# EAGLE design ArduinoMEGAReferenceShield (EAGLE 6.3)
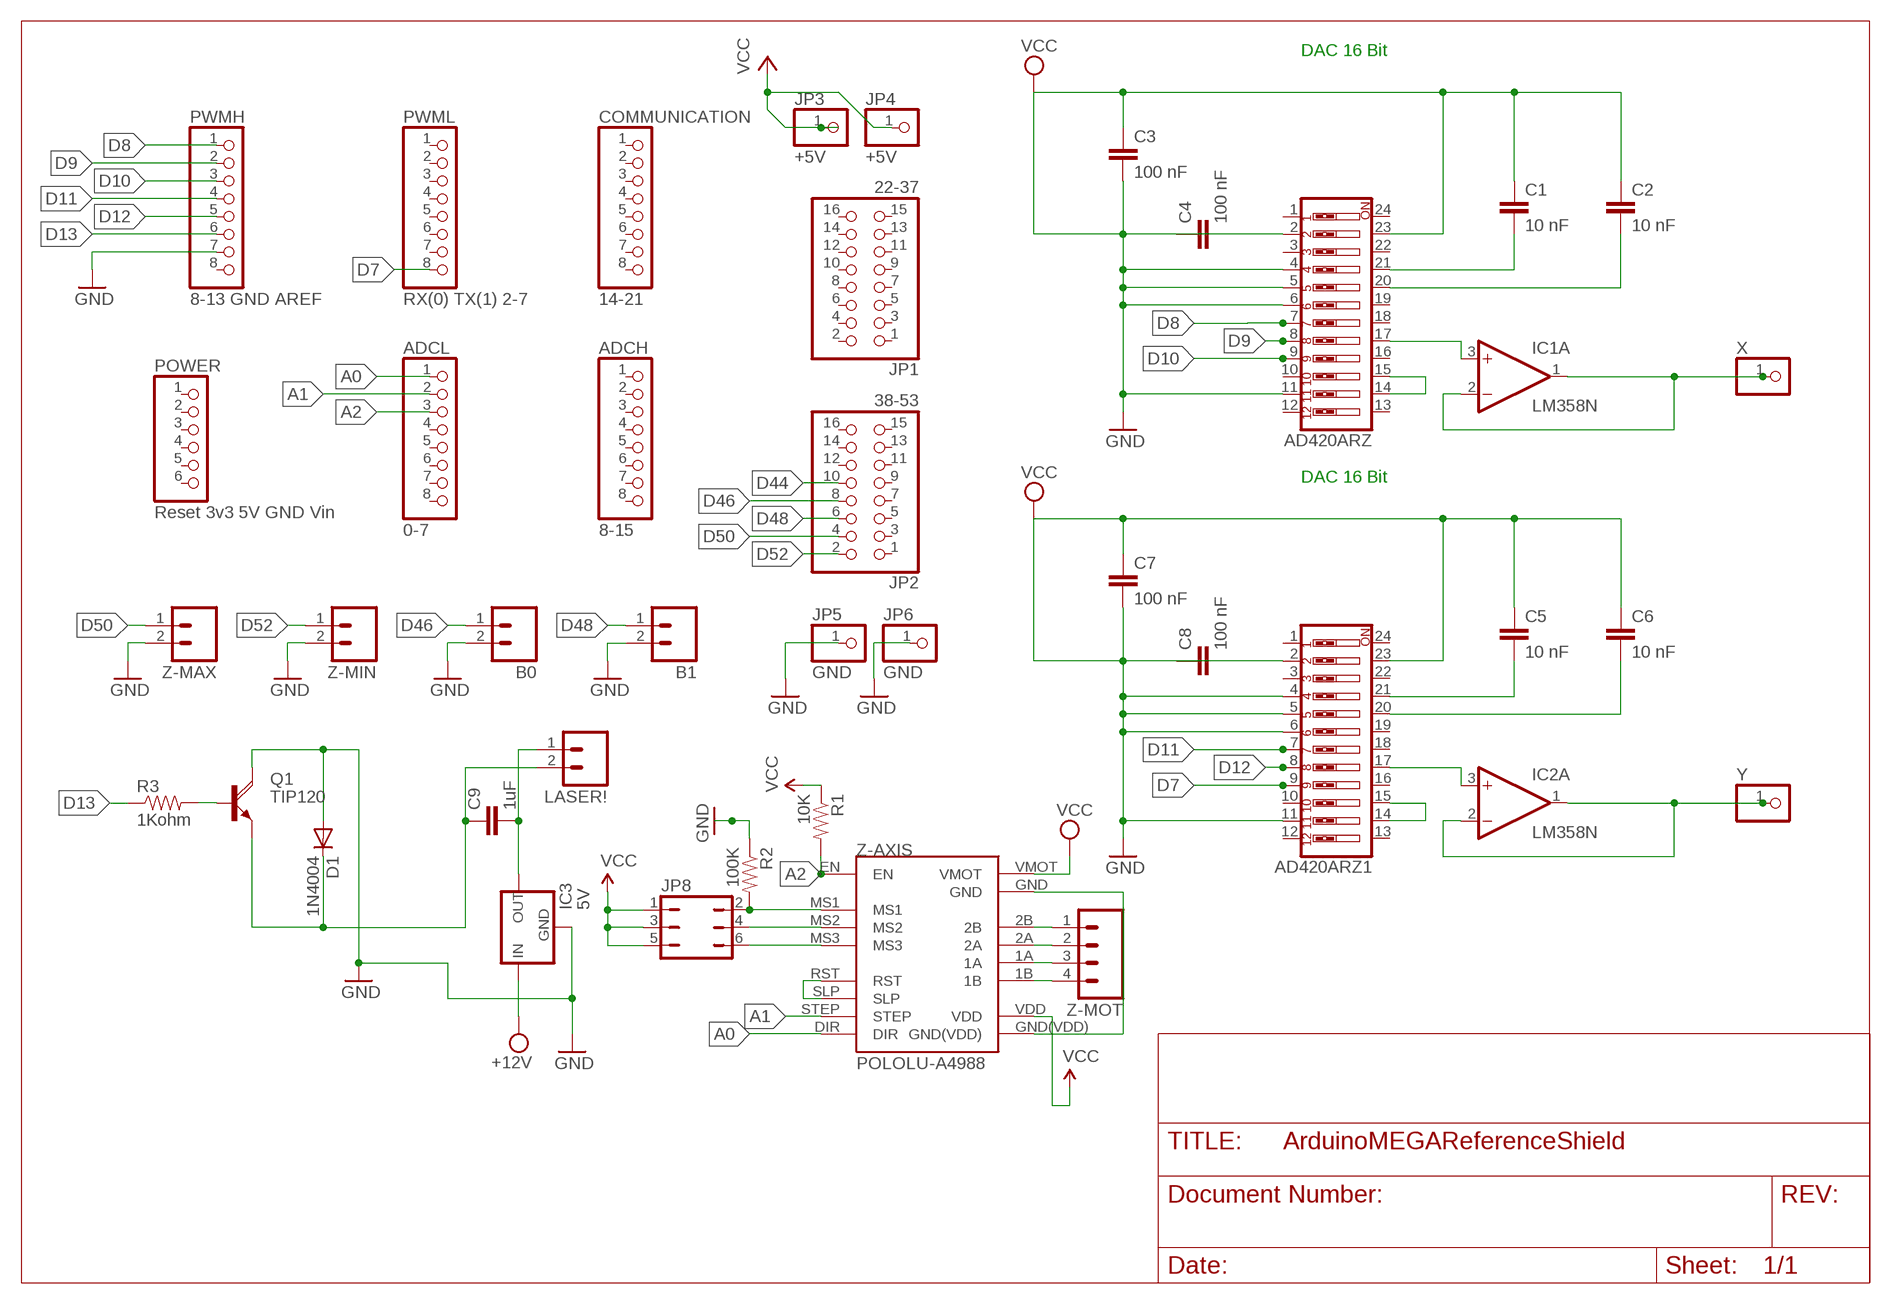
[diagram p0: schematic, sheet 1]

## Parts
AD420ARZ  SW_DIP-12  [EDG-12]
AD420ARZ1  SW_DIP-12  [EDG-12]
ADCH  8-15  PINHD-1X8  [1X08]
ADCL  0-7  PINHD-1X8  [1X08]
B0  M02PTH  [1X02]
B1  M02PTH  [1X02]
C1  10 nF  C2,5-3  [C2.5-3]
C2  10 nF  C2,5-3  [C2.5-3]
C3  100 nF  C2,5-3  [C2.5-3]
C4  100 nF  C2,5-3  [C2.5-3]
C5  10 nF  C2,5-3  [C2.5-3]
C6  10 nF  C2,5-3  [C2.5-3]
C7  100 nF  C2,5-3  [C2.5-3]
C8  100 nF  C2,5-3  [C2.5-3]
C9  1uF  CAPPTH  [CAP-PTH-SMALL]
COMMUNICATION  14-21  PINHD-1X8  [1X08]
D1  1N4004  [DO41-10]
IC1  LM358N  [DIL08]
IC2  LM358N  [DIL08]
IC3  5V  V_REG_78XXSIDE  [78XXL]
JP1  22-37  PINHD-2X8  [2X08]
JP2  38-53  PINHD-2X8  [2X08]
JP3  +5V  PINHD-1X1  [1X01]
JP4  +5V  PINHD-1X1  [1X01]
JP5  GND  PINHD-1X1  [1X01]
JP6  GND  PINHD-1X1  [1X01]
JP8  JP3Q  [JP3Q]
LASER!  M02POLAR  [MOLEX-1X2]
POWER  Reset 3v3 5V GND Vin  PINHD-1X6  [1X06]
PWMH  8-13 GND AREF  PINHD-1X8  [1X08]
PWML  RX(0) TX(1) 2-7  PINHD-1X8  [1X08]
Q1  TIP120  [TO220AH]
R1  10K  RESISTORAXIAL-0.3  [AXIAL-0.3]
R2  100K  RESISTORAXIAL-0.3  [AXIAL-0.3]
R3  1Kohm  RESISTORAXIAL-0.3  [AXIAL-0.3]
X  PINHD-1X1  [1X01]
Y  PINHD-1X1  [1X01]
Z-AXIS  POLOLU-A4988  [DIL_A4988]
Z-MAX  M02PTH  [1X02]
Z-MIN  M02PTH  [1X02]
Z-MOT  M04POLAR  [MOLEX-1X4]

## Nets
A0: ADCL.1 Z-AXIS.DIR
A1: ADCL.2 Z-AXIS.STEP
A2: ADCL.3 R1.P$2 Z-AXIS.EN
D7: AD420ARZ1.9 PWML.8
D8: AD420ARZ.7 PWMH.1
D9: AD420ARZ.8 PWMH.2
D10: AD420ARZ.9 PWMH.3
D11: AD420ARZ1.7 PWMH.4
D12: AD420ARZ1.8 PWMH.5
D13: PWMH.6 R3.P$1
D44: JP2.10 Q1.B R3.P$2
D46: B0.1 JP2.8
D48: B1.1 JP2.6
D50: JP2.4 Z-MAX.1
D52: JP2.2 Z-MIN.1
GND: AD420ARZ1.2 AD420ARZ1.4 AD420ARZ1.5 AD420ARZ1.6 AD420ARZ1.11 AD420ARZ1.23 AD420ARZ.2 AD420ARZ.4 AD420ARZ.5 AD420ARZ.6 AD420ARZ.11 AD420ARZ.23 B0.2 B1.2 C1.1 C2.1 C3.1 C3.2 C4.1 C4.2 C5.1 C6.1 C7.1 C7.2 C8.1 C8.2 D1.A IC3.GND JP5.1 JP6.1 PWMH.7 Q1.C R2.P$1 Z-MAX.2 Z-MIN.2 ; supply symbol labelled VCC
N$1: AD420ARZ1.21 C5.2
N$2: AD420ARZ1.20 C6.2
N$3: AD420ARZ.21 C1.2
N$4: AD420ARZ.20 C2.2
N$5: AD420ARZ.17 IC1.3(A:+IN)
N$6: AD420ARZ.14 AD420ARZ.15
N$7: IC1.1(A:OUT) IC1.2(A:-IN) X.1
N$8: AD420ARZ1.17 IC2.3(A:+IN)
N$9: AD420ARZ1.14 AD420ARZ1.15
N$10: IC2.1(A:OUT) IC2.2(A:-IN) Y.1
N$11: Z-AXIS.RST Z-AXIS.SLP
N$12: C9.2 IC3.OUT LASER!.1
N$13: C9.1 D1.C LASER!.2 Q1.E
N$14: Z-AXIS.GND Z-AXIS.GND(VDD)
N$15: JP8.2 R2.P$2 Z-AXIS.MS1
N$16: JP8.4 Z-AXIS.MS2
N$17: JP8.6 Z-AXIS.MS3
N$20: Z-AXIS.2B Z-MOT.1
N$21: Z-AXIS.2A Z-MOT.2
N$22: Z-AXIS.1A Z-MOT.3
N$23: Z-AXIS.1B Z-MOT.4
VCC: IC3.IN JP3.1 JP4.1 JP8.1 JP8.3 JP8.5 R1.P$1 Z-AXIS.VDD Z-AXIS.VMOT ; supply symbol labelled +12V
Unconnected: AD420ARZ1.1 AD420ARZ1.3 AD420ARZ1.10 AD420ARZ1.12 AD420ARZ1.13 AD420ARZ1.16 AD420ARZ1.18 AD420ARZ1.19 AD420ARZ1.22 AD420ARZ1.24 AD420ARZ.1 AD420ARZ.3 AD420ARZ.10 AD420ARZ.12 AD420ARZ.13 AD420ARZ.16 AD420ARZ.18 AD420ARZ.19 AD420ARZ.22 AD420ARZ.24 ADCH.1 ADCH.2 ADCH.3 ADCH.4 ADCH.5 ADCH.6 ADCH.7 ADCH.8 ADCL.4 ADCL.5 ADCL.6 ADCL.7 ADCL.8 COMMUNICATION.1 COMMUNICATION.2 COMMUNICATION.3 COMMUNICATION.4 COMMUNICATION.5 COMMUNICATION.6 COMMUNICATION.7 COMMUNICATION.8 IC1.5(B:+IN) IC1.6(B:-IN) IC1.7(B:OUT) IC2.5(B:+IN) IC2.6(B:-IN) IC2.7(B:OUT) JP1.1 JP1.2 JP1.3 JP1.4 JP1.5 JP1.6 JP1.7 JP1.8 JP1.9 JP1.10 JP1.11 JP1.12 JP1.13 JP1.14 JP1.15 JP1.16 JP2.1 JP2.3 JP2.5 JP2.7 JP2.9 JP2.11 JP2.12 JP2.13 JP2.14 JP2.15 JP2.16 POWER.1 POWER.2 POWER.3 POWER.4 POWER.5 POWER.6 PWMH.8 PWML.1 PWML.2 PWML.3 PWML.4 PWML.5 PWML.6 PWML.7

## Notes on the sheet
- DAC 16 Bit
- DAC 16 Bit

## Power pins joined to a net without a drawn wire
V+: IC1.8(P:V+) IC2.8(P:V+)
V-: IC1.4(P:V-) IC2.4(P:V-)

## Library data of the parts
AD420ARZ AD420ARZ1 = special:SW_DIP-12: DIP SWITCH
ADCH ADCL COMMUNICATION PWMH PWML = pinhead:PINHD-1X8: PIN HEADER
B0 B1 LASER! Z-MAX Z-MIN = SparkFun:M02: Header 2 Standard 2-pin 0.1" header. Use with straight break away headers (SKU : PRT-00116), right angle break away headers (PRT-00553), swiss pins (PRT-00743), machine pins (PRT-00117), and female headers (PRT-00115). Molex polarized connector foot print use with SKU : PRT-08233 with associated crimp pins and housings.
C1-C8 = capacitor-wima:C: CAPACITOR naming: grid - package width
C9 = SparkFun:CAP: Capacitor Standard 0603 ceramic capacitor, and 0.1" leaded capacitor.
D1 = diode:1N4004: DIODE general purpose rectifier, 1 A
IC1 IC2 = linear:LM358: OP AMP also LM158; LM258; LM2904 Source: http://cache.national.com/ds/LM/LM158.pdf
IC3 = SparkFun:V_REG_78XX: Voltage Regulator Standard 7805 5V regulator. IGO (Input Ground Output). Spark Fun Electronics SKU : COM-00107
JP1 JP2 = pinhead:PINHD-2X8: PIN HEADER
JP3-JP6 X Y = pinhead:PINHD-1X1: PIN HEADER
JP8 = jumper:JP3Q: JUMPER
POWER = pinhead:PINHD-1X6: PIN HEADER
Q1 = transistor-power:TIP120: NPN DARLINGTON TRANSISTOR
R1-R3 = SparkFun:RESISTOR: Resistor Basic schematic elements and footprints for 0603, 1206, and PTH resistors.
Z-AXIS = Pololu-A4988:POLOLU-A4988
Z-MOT = SparkFun:M04: Header 4 Standard 4-pin 0.1" header. Use with straight break away headers (SKU : PRT-00116), right angle break away headers (PRT-00553), swiss pins (PRT-00743), machine pins (PRT-00117), and female headers (PRT-00115). Molex polarized connector foot print use with SKU : PRT-08231 with associated crimp pins and housings. 1MM SMD Version SKU: PRT-10208

## Net classes
0 default: width 0.203 mm, drill 0.406 mm, clearance 0.203 mm
1 power: width 0.61 mm, drill 0.711 mm, clearance 0.203 mm
2 gnd: width 0.305 mm, drill 0.711 mm, clearance 0.203 mm
3 usbvcc: width 0.508 mm, drill 0.711 mm, clearance 0.203 mm

## Board
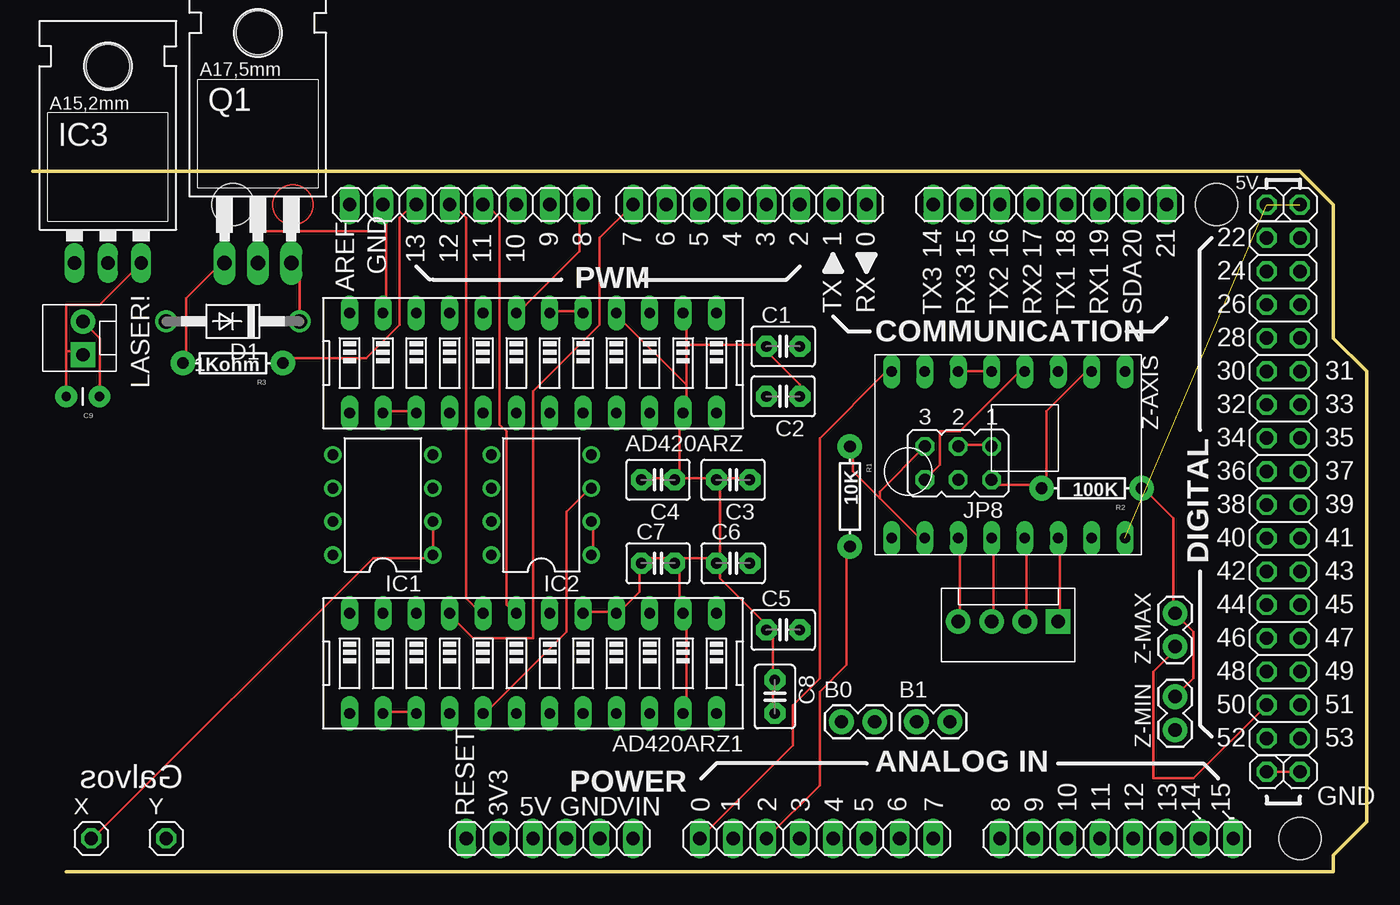
[diagram p1: board, top side]
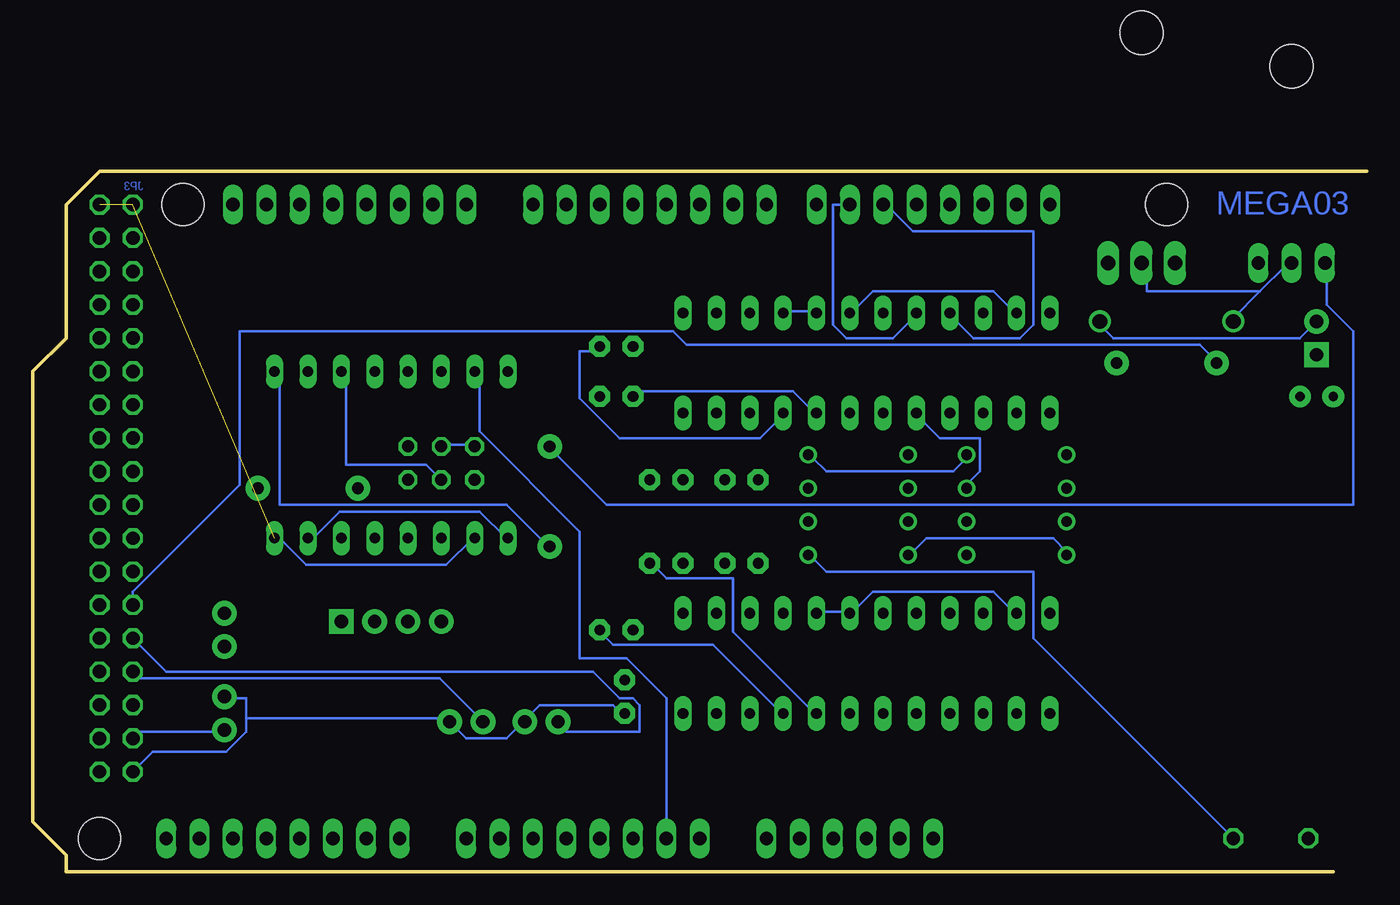
[diagram p2: board, bottom side, seen from below]

Size 101.6 x 53.34 mm. Coordinates in mm from the lower left corner, seen from the top.
Outline: 0,53.34 96.52,53.34 99.06,50.8 99.06,40.64 101.6,38.1 101.6,3.81 99.06,1.27 99.06,0 2.54,0
Copper layers (1*16): Top 0.035mm / dielectric 1.5mm / Bottom 0.035mm
Design rules "default *": minimum track width 8mil, minimum drill 16mil, track to track 8mil, track to pad 8mil, pad to pad 8mil, via to via 10mil, smd to smd 8mil, copper to edge 40mil, drill to drill 12mil, minimum pad ring 10mil, minimum via ring 10mil, stop-mask expansion 4mil, vias tented up to drill 0mil, thermal gap 10mil
Holes 3.2 mm at 96.52,2.54 15.24,50.8 90.17,50.8

### Footprints (pad centres in the part's own frame; a part is rotated, then mirrored left to right if it is on the bottom)
EDG-12 = drill 0.813 long: 1 -13.97,-3.81; 2 -11.43,-3.81; 3 -8.89,-3.81; 4 -6.35,-3.81; 5 -3.81,-3.81; 6 -1.27,-3.81; 7 1.27,-3.81; 8 3.81,-3.81; 9 6.35,-3.81; 10 8.89,-3.81; 11 11.43,-3.81; 12 13.97,-3.81; 13 13.97,3.81; 14 11.43,3.81; 15 8.89,3.81; 16 6.35,3.81; 17 3.81,3.81; 18 1.27,3.81; 19 -1.27,3.81; 20 -3.81,3.81; 21 -6.35,3.81; 22 -8.89,3.81; 23 -11.43,3.81; 24 -13.97,3.81
1X08 = drill 1.016 long: 1 -8.89,0; 2 -6.35,0; 3 -3.81,0; 4 -1.27,0; 5 1.27,0; 6 3.81,0; 7 6.35,0; 8 8.89,0
1X02 = drill 1.016 pad 1.88: 1 0,0; 2 2.54,0
C2.5-3 = drill 0.813 pad 1.6 octagon: 1 -1.27,0; 2 1.27,0
CAP-PTH-SMALL = drill 0.7 pad 1.651: 1 0,0; 2 2.54,0
DO41-10 = drill 1.118: A 5.08,0; C -5.08,0
DIL08 = drill 0.813 pad 1.27: 1 -3.81,-3.81; 2 -1.27,-3.81; 3 1.27,-3.81; 4 3.81,-3.81; 5 3.81,3.81; 6 1.27,3.81; 7 -1.27,3.81; 8 -3.81,3.81
78XXL = drill 1.016 long: GND 0,-3.81; IN -2.54,-3.81; OUT 2.54,-3.81 | hole 3.302: 0,11.176
2X08 = drill 1.016 octagon: 1 -8.89,-1.27; 2 -8.89,1.27; 3 -6.35,-1.27; 4 -6.35,1.27; 5 -3.81,-1.27; 6 -3.81,1.27; 7 -1.27,-1.27; 8 -1.27,1.27; 9 1.27,-1.27; 10 1.27,1.27; 11 3.81,-1.27; 12 3.81,1.27; 13 6.35,-1.27; 14 6.35,1.27; 15 8.89,-1.27; 16 8.89,1.27
1X01 = drill 1.016 octagon: 1 0,0
JP3Q = drill 0.914 octagon: 1 -2.54,-1.27; 2 -2.54,1.27; 3 0,-1.27; 4 0,1.27; 5 2.54,-1.27; 6 2.54,1.27
MOLEX-1X2 = drill 1.016 pad 1.88 square: 1 0,0 | drill 1.016 pad 1.88: 2 2.54,0
1X06 = drill 1.016 long: 1 -6.35,0; 2 -3.81,0; 3 -1.27,0; 4 1.27,0; 5 3.81,0; 6 6.35,0
TO220AH = drill 1.118 long: B -2.54,-6.35; C 0,-6.35; E 2.54,-6.35 | hole 3.302: 0,11.176
AXIAL-0.3 = drill 0.9 pad 1.88: P$1 -3.81,0; P$2 3.81,0
FIDUCIA-MOUNT = smd 1.016 x 1.016: P$1 0,0
DIL_A4988 = drill 0.8 long: 1A 12.7,7.62; 1B 12.7,5.08; 2A 12.7,10.16; 2B 12.7,12.7; DIR 0,0; EN 0,17.78; GND 12.7,15.24; GND(VDD) 12.7,0; MS1 0,15.24; MS2 0,12.7; MS3 0,10.16; RST 0,7.62; SLP 0,5.08; STEP 0,2.54; VDD 12.7,2.54; VMOT 12.7,17.78
MOLEX-1X4 = drill 1.016 pad 1.88 square: 1 0,0 | drill 1.016 pad 1.88: 2 2.54,0; 3 5.08,0; 4 7.62,0

### Placement (x,y rotation side)
AD420ARZ  38.1,38.73 180 top
AD420ARZ1  38.1,15.88 180 top
ADCH  82.55,2.54 0 top
ADCL  59.69,2.54 0 top
B0  61.59,11.43 0 top
B1  67.31,11.43 0 top
C1  57.15,40.01 0 top
C2  57.15,36.2 180 top
C3  53.34,29.84 180 top
C4  47.62,29.84 180 top
C5  57.15,18.41 0 top
C6  53.34,23.5 0 top
C7  47.62,23.5 0 top
C8  56.52,13.34 270 top
C9  5.08,36.2 180 top
COMMUNICATION  77.47,50.8 180 top
D1  15.24,41.91 180 top
IC1  26.67,27.94 90 top
IC2  38.73,27.94 90 top
IC3  5.71,50.16 0 top
JP1  95.25,39.37 90 top
JP2  95.25,19.05 90 top
JP3  93.98,50.8 0 top
JP4  96.52,50.8 0 top
JP5  93.98,7.62 0 top
JP6  96.52,7.62 0 top
JP8  70.48,31.11 180 top
LASER!  3.81,39.37 90 top
POWER  39.37,2.54 0 top
PWMH  33.02,50.8 180 top
PWML  54.61,50.8 180 top
Q1  17.14,52.7 0 top
R1  62.23,28.57 270 top
R2  80.64,29.21 180 top
R3  15.24,38.73 180 top
U$3  FIDUCIALMOUNT  [FIDUCIA-MOUNT]  19.81,50.8 0 top
X  4.45,2.54 0 top
Y  10.16,2.54 0 top
Z-AXIS  65.41,38.1 270 top
Z-MAX  87,17.14 90 top
Z-MIN  87,10.79 90 top
Z-MOT  78.11,19.05 180 top

### Tracks (layer width: path | path; a pad name or v marks a point on that pad's centre or on a via)
A0
  Top 0.203: ADCL.1 57.91,9.65 57.91,12.7 59.94,14.73 59.94,33.02 65.02,38.1 Z-AXIS.DIR
A1
  Bottom 0.203: ADCL.2 53.34,13.21 56.39,16.26 59.94,16.26 59.94,25.91 67.56,33.53 67.56,38.1 Z-AXIS.STEP
A2
  Top 0.203: ADCL.3 59.94,6.6 59.94,13.72 61.98,15.75 61.98,24.38 R1.P$2
  Bottom 0.203: Z-AXIS.EN 82.8,38.1 82.8,27.94 65.53,27.94 62.48,24.89 R1.P$2
D7
  Top 0.203: PWML.8 43.18,48.26 43.18,41.66 38.1,36.58 38.1,17.78 33.53,17.78 32,19.3 AD420ARZ1.9
D8
  Top 0.203: AD420ARZ.7 37.08,42.67 41.66,47.24 41.66,50.8 PWMH.1
D9
  Bottom 0.203: PWMH.2 40.64,50.8 40.64,41.66 39.62,40.64 36.07,40.64 34.54,42.16 AD420ARZ.8
D10
  Bottom 0.203: AD420ARZ.9 31.5,42.16 29.97,40.64 26.42,40.64 25.4,41.66 25.4,48.77 34.54,48.77 36.58,50.8 PWMH.3
D11
  Top 0.203: AD420ARZ1.7 36.58,19.81 36.07,20.32 36.07,33.53 35.56,34.04 35.56,49.78 34.54,50.8 PWMH.4
D12
  Top 0.203: AD420ARZ1.8 34.04,19.81 33.02,20.83 33.02,49.78 32,50.8 PWMH.5
D13
  Top 0.203: PWMH.6 28.96,50.8 27.94,49.78 27.94,41.66 25.4,39.12 19.3,39.12 R3.P$1
D44
  Top 0.203: Q1.B 14.22,46.23 11.68,43.69 11.68,39.12 R3.P$2
  Bottom 0.203: JP2.10 93.98,21.34 85.85,29.46 85.85,41.15 52.83,41.15 51.82,40.13 12.7,40.13 11.68,39.12 R3.P$2
D46
  Bottom 0.203: JP2.8 91.44,15.24 58.93,15.24 56.9,13.21 55.88,13.21 55.37,12.7 55.37,10.67 60.96,10.67 61.47,11.18 B0.1
D48
  Bottom 0.203: JP2.6 93.47,14.73 70.61,14.73 B1.1
D50
  Top 0.203: JP2.4 88.39,7.11 85.34,7.11 85.34,15.24 86.87,16.76 Z-MAX.1
D52
  Bottom 0.203: JP2.2 93.47,10.67 87.38,10.67 Z-MIN.1
GND
  Top 0.203: 26.92,48.77 26.92,50.8 PWMH.7 | 26.92,48.77 26.92,42.67 AD420ARZ.11 | 26.92,48.77 17.27,48.77 17.27,46.74 Q1.C | C2.1 58.42,37.08 55.88,39.62 C1.1 55.88,40.13 49.78,40.13 | AD420ARZ.6 39.62,42.67 41.66,42.67 AD420ARZ.5 | C3.2 52.32,29.97 54.36,29.97 C3.1 | 49.28,29.97 49.28,34.54 AD420ARZ.23 49.78,35.05 49.78,37.08 | 49.78,37.08 49.78,40.13 | 49.78,40.13 49.78,42.16 AD420ARZ.2 | C4.2 46.74,29.97 48.77,29.97 C4.1 49.28,29.97 | 49.28,29.97 51.82,29.97 C3.2 | 49.78,37.08 44.7,42.16 AD420ARZ.4 | JP6.1 JP5.1 | Z-MIN.2 88.39,14.73 88.39,18.29 Z-MAX.2 86.87,19.81 86.87,26.92 84.84,28.96 R2.P$1 | AD420ARZ1.5 42.16,19.81 44.2,19.81 AD420ARZ1.4 44.7,19.81 46.23,21.34 46.23,23.37 C7.1 46.74,23.88 48.77,23.88 C7.2 | C8.2 56.39,12.19 56.39,14.22 C8.1 56.39,14.73 56.39,17.78 55.88,18.29 C5.1 55.88,18.8 52.32,22.35 52.32,23.37 C6.1 | C6.1 51.82,23.88 49.28,23.88 C7.2 | AD420ARZ1.23 49.78,12.19 49.78,19.3 AD420ARZ1.2 49.28,19.81 49.28,23.37 C7.2 | C3.2 52.32,29.46 52.32,23.88 C6.1
  Bottom 0.203: 8.13,44.2 10.16,42.16 D1.A | 8.13,44.2 6.1,46.23 IC3.GND | 8.13,44.2 16.76,44.2 16.76,46.23 Q1.C | AD420ARZ.4 44.2,42.67 42.16,42.67 AD420ARZ.5 | AD420ARZ.11 26.92,42.67 28.45,44.2 37.59,44.2 39.12,42.67 AD420ARZ.6 | JP5.1 92.46,9.14 86.87,9.14 85.34,10.67 85.34,11.68 | 85.34,11.68 85.34,13.21 86.87,13.21 Z-MIN.2 | AD420ARZ1.11 26.92,19.81 28.45,21.34 37.59,21.34 39.12,19.81 AD420ARZ1.6 39.62,19.81 41.66,19.81 AD420ARZ1.5 | C8.2 56.9,12.19 57.4,12.7 62.99,12.7 64.01,11.68 B0.2 64.52,11.18 65.53,10.16 68.58,10.16 B1.2 70.1,11.68 85.34,11.68
N$1
  Bottom 0.203: AD420ARZ1.21 44.7,12.19 49.78,17.27 57.4,17.27 58.42,18.29 C5.2
N$2
  Bottom 0.203: AD420ARZ1.20 42.16,12.19 48.26,18.29 48.26,22.35 53.34,22.35 54.36,23.37 C6.2
N$3
  Bottom 0.203: AD420ARZ.21 44.7,34.54 46.23,33.02 56.9,33.02 59.94,36.07 59.94,39.62 58.42,39.62 C1.2
N$4
  Bottom 0.203: AD420ARZ.20 42.16,35.05 43.69,36.58 55.88,36.58 C2.2
N$5
  Bottom 0.203: IC1.3 30.48,29.46 29.46,30.48 29.46,33.02 32.51,33.02 34.04,34.54 AD420ARZ.17
N$6
  Top 0.203: AD420ARZ.14 26.92,35.05 28.96,35.05 AD420ARZ.15
N$7
  Top 0.203: IC1.2 IC1.1 30.48,23.88 25.91,23.88 4.57,2.54 X.1
N$8
  Top 0.203: AD420ARZ1.17 34.54,12.19 40.64,18.29 40.64,27.43 42.16,28.96 IC2.3
N$9
  Top 0.203: AD420ARZ1.14 26.92,12.19 28.96,12.19 AD420ARZ1.15
N$10
  Top 0.203: IC2.1 42.67,24.38 42.67,26.42 IC2.2
  Bottom 0.203: Y.1 25.4,17.78 25.4,22.86 41.15,22.86 42.16,23.88 IC2.1
N$11
  Top 0.203: Z-AXIS.RST Z-AXIS.SLP
N$12
  Top 0.203: IC3.OUT 5.08,43.18 2.54,43.18 2.54,39.62 | C9.2 2.54,39.62 | 2.54,39.62 3.56,39.62 LASER!.1
N$13
  Top 0.203: Q1.E 20.32,45.72 D1.C | C9.1 5.08,40.64 LASER!.2
  Bottom 0.203: LASER!.2 5.08,40.64 19.3,40.64 20.32,41.66 D1.C
N$14
  Bottom 0.203: Z-AXIS.GND(VDD) 65.53,25.4 67.56,27.43 78.23,27.43 80.26,25.4 Z-AXIS.GND
N$15
  Top 0.203: Z-AXIS.MS1 80.26,38.1 77.22,35.05 77.22,29.46 R2.P$2 76.71,29.46 73.15,29.46 JP8.2
N$16
  Bottom 0.203: JP8.4 71.63,30.99 77.72,30.99 77.72,38.1 Z-AXIS.MS2
N$17
  Top 0.203: JP8.6 69.09,30.99 69.09,33.53 70.61,33.53 75.18,38.1 Z-AXIS.MS3
N$20
  Top 0.203: Z-AXIS.2B 78.23,25.4 78.23,19.3 Z-MOT.1
N$21
  Top 0.203: Z-AXIS.2A 75.69,25.4 75.69,19.3 Z-MOT.2
N$22
  Top 0.203: Z-AXIS.1A 73.15,25.4 73.15,19.3 Z-MOT.3
N$23
  Top 0.203: Z-AXIS.1B 70.61,25.4 70.61,19.3 Z-MOT.4
V+
  Bottom 0.203: IC1.8 22.86,24.38 23.88,25.4 33.53,25.4 34.54,24.38 IC2.8
V-
  Bottom 0.203: IC1.4 30.48,31.5 31.5,30.48 41.15,30.48 42.16,31.5 IC2.4
VCC  (2 unrouted)
  Top 0.203: JP8.1 72.64,32.51 70.61,32.51 JP8.3 | 64.52,28.45 62.48,30.48 62.48,32 R1.P$1 | 64.52,28.45 67.56,25.4 Z-AXIS.VDD | JP8.5 64.52,28.96 64.52,28.45
  Bottom 0.203: JP8.5 68.07,32.51 70.1,32.51 JP8.3 | Z-AXIS.VMOT 82.8,25.4 80.77,23.37 70.1,23.37 68.07,25.4 Z-AXIS.VDD | IC3.IN 3.05,46.23 3.05,43.18 1.02,41.15 1.02,27.94 57.91,27.94 61.98,32 R1.P$1

### Text on the board
Bottom: MEGA03
tPlace: 9 | 8 | 7 | 6 | 5 | 4 | 3 | 2 | 1 | 0 | 22 | 14 | 15 | 16 | 17 | 18 | 19 | 20 | 21 | 13 | 12 | 11 | 10 | 24 | 26 | 28 | LASER! | 30 | 31 | 32 | 33 | 34 | 35 | 36 | 37 | 38 | 39 | 40 | 41 | 42 | 43 | 44 | 45 | 46 | 47 | 48 | 49 | 50 | 51 | 52 | 53 | 0 | 1 | 2 | 3 | 4 | 5 | 6 | 7 | 8 | 9 | 10 | 11 | 12 | 13 | 14 | 15
tNames: 5V | GND | AREF | PWM | TX | RX | TX3 | RX3 | TX2 | RX2 | TX1 | RX1 | SDA | DIGITAL | ANALOG IN | Galvos | GND | RESET | 3V3 | 5V | GND | VIN